# EAGLE board first_board5 (EAGLE 7.2.0)
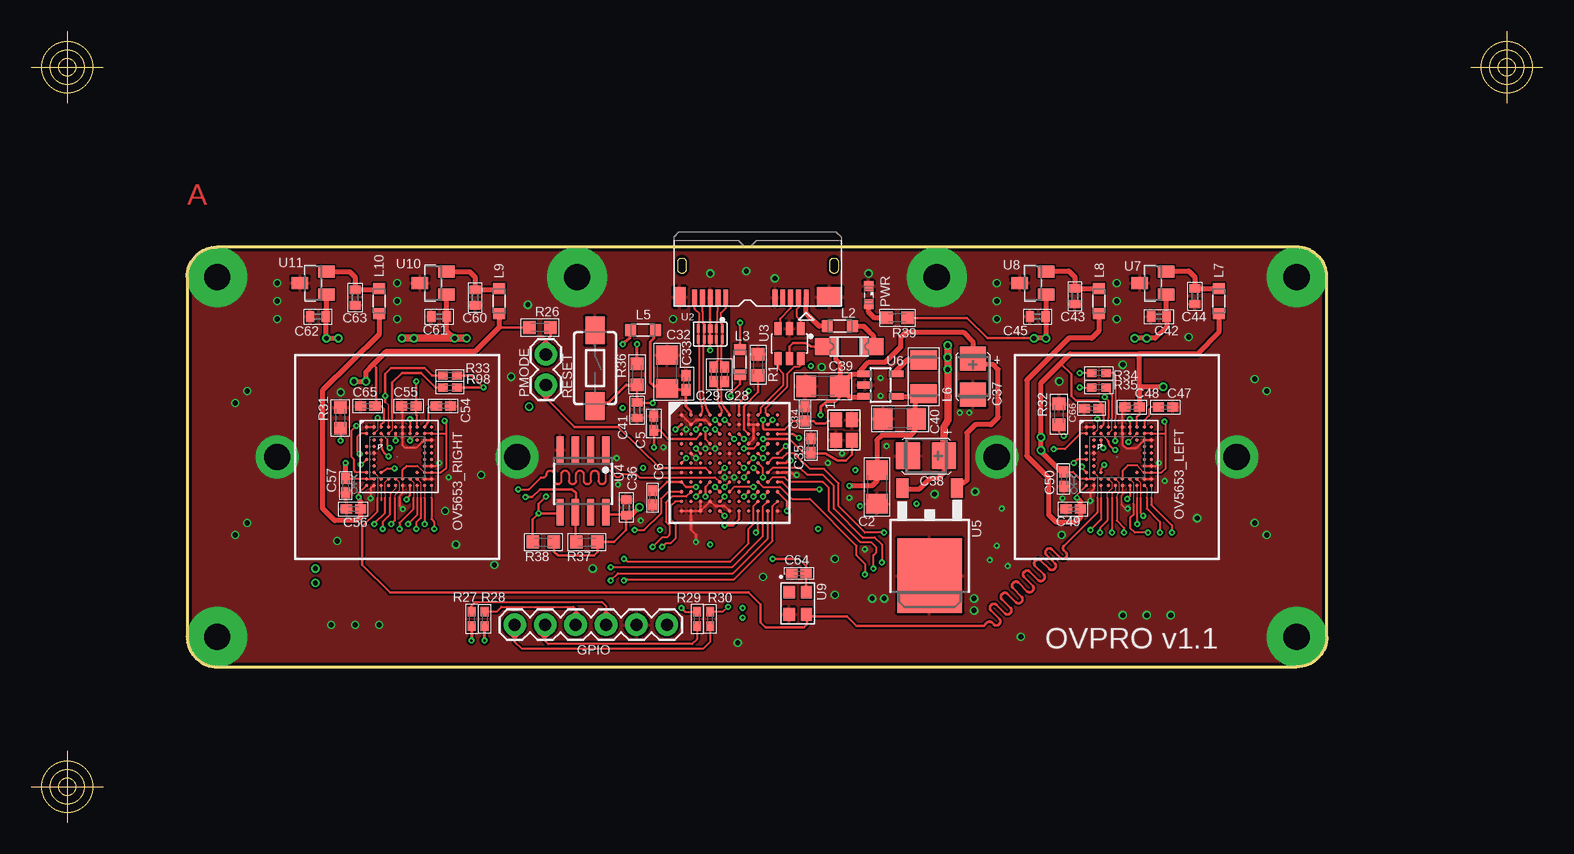
[diagram p2: board, top side]
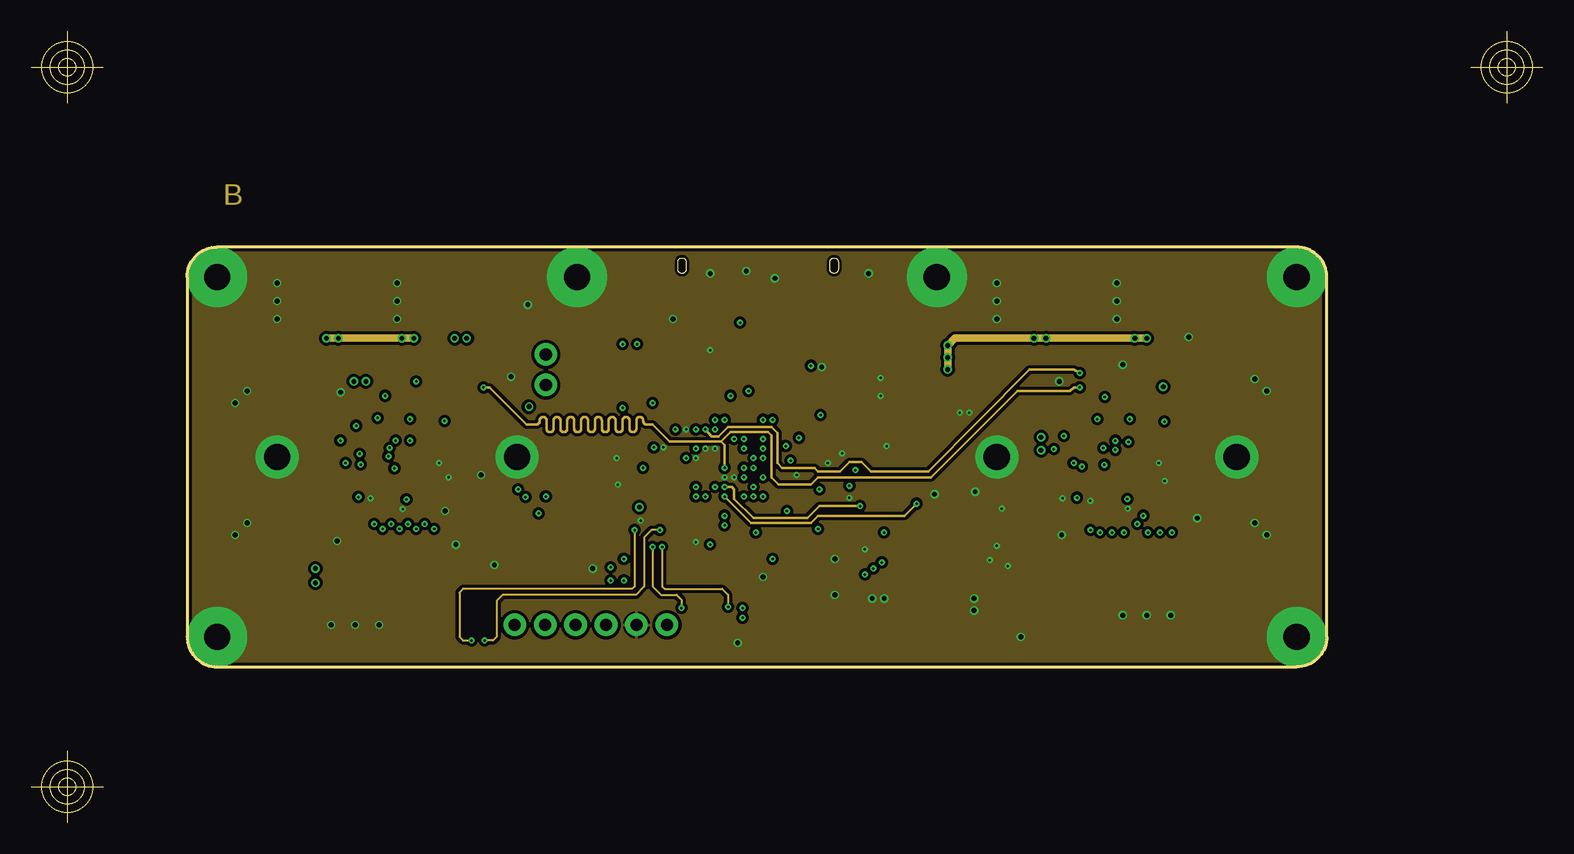
[diagram p3: board, inner layer GND,Signal]
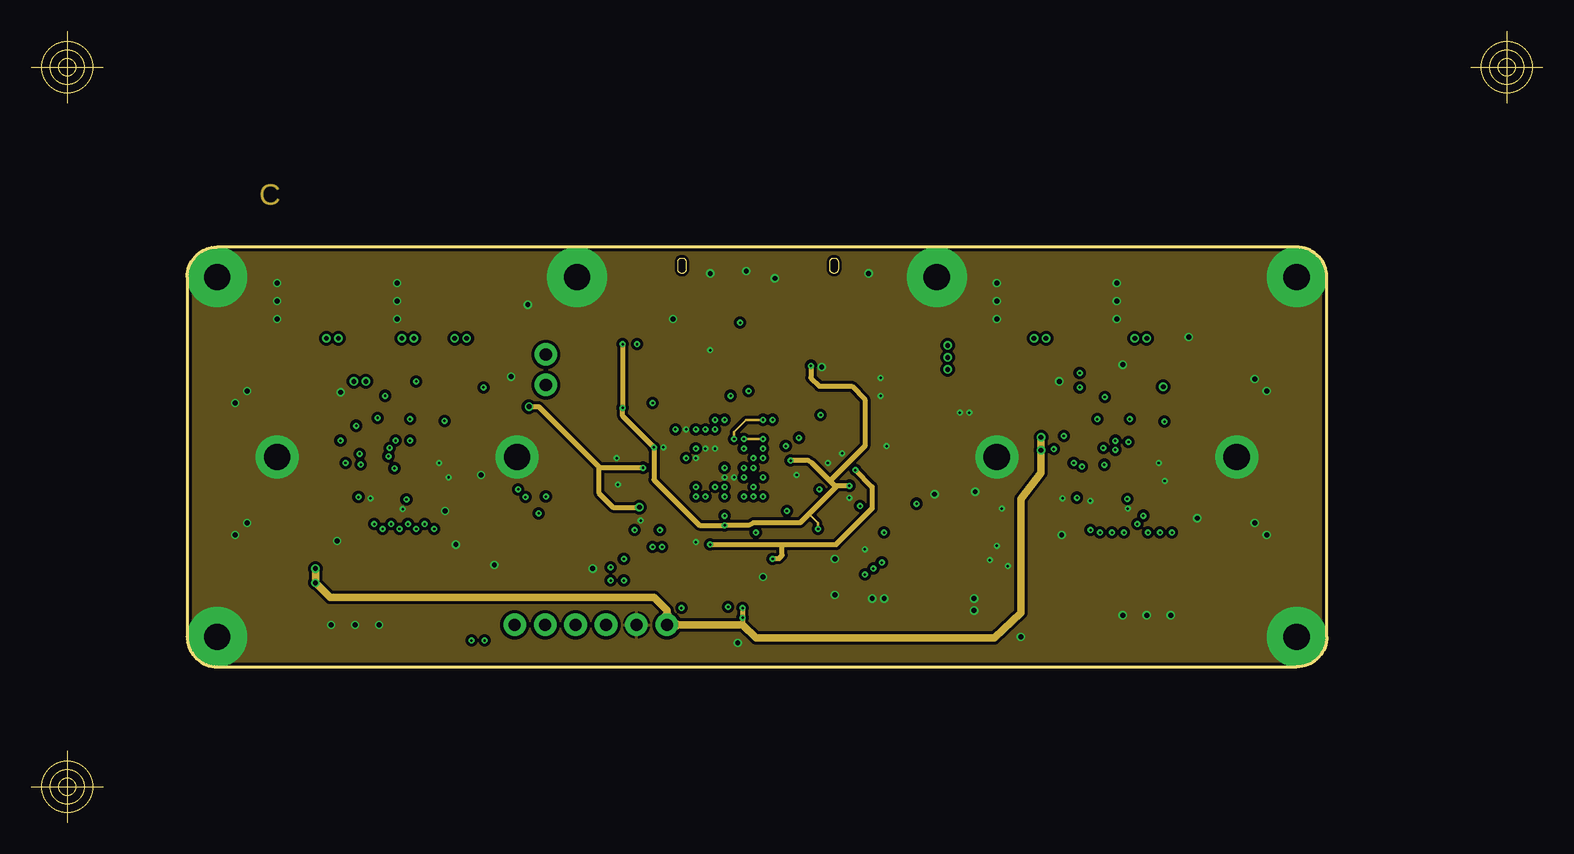
[diagram p4: board, inner layer Supply]
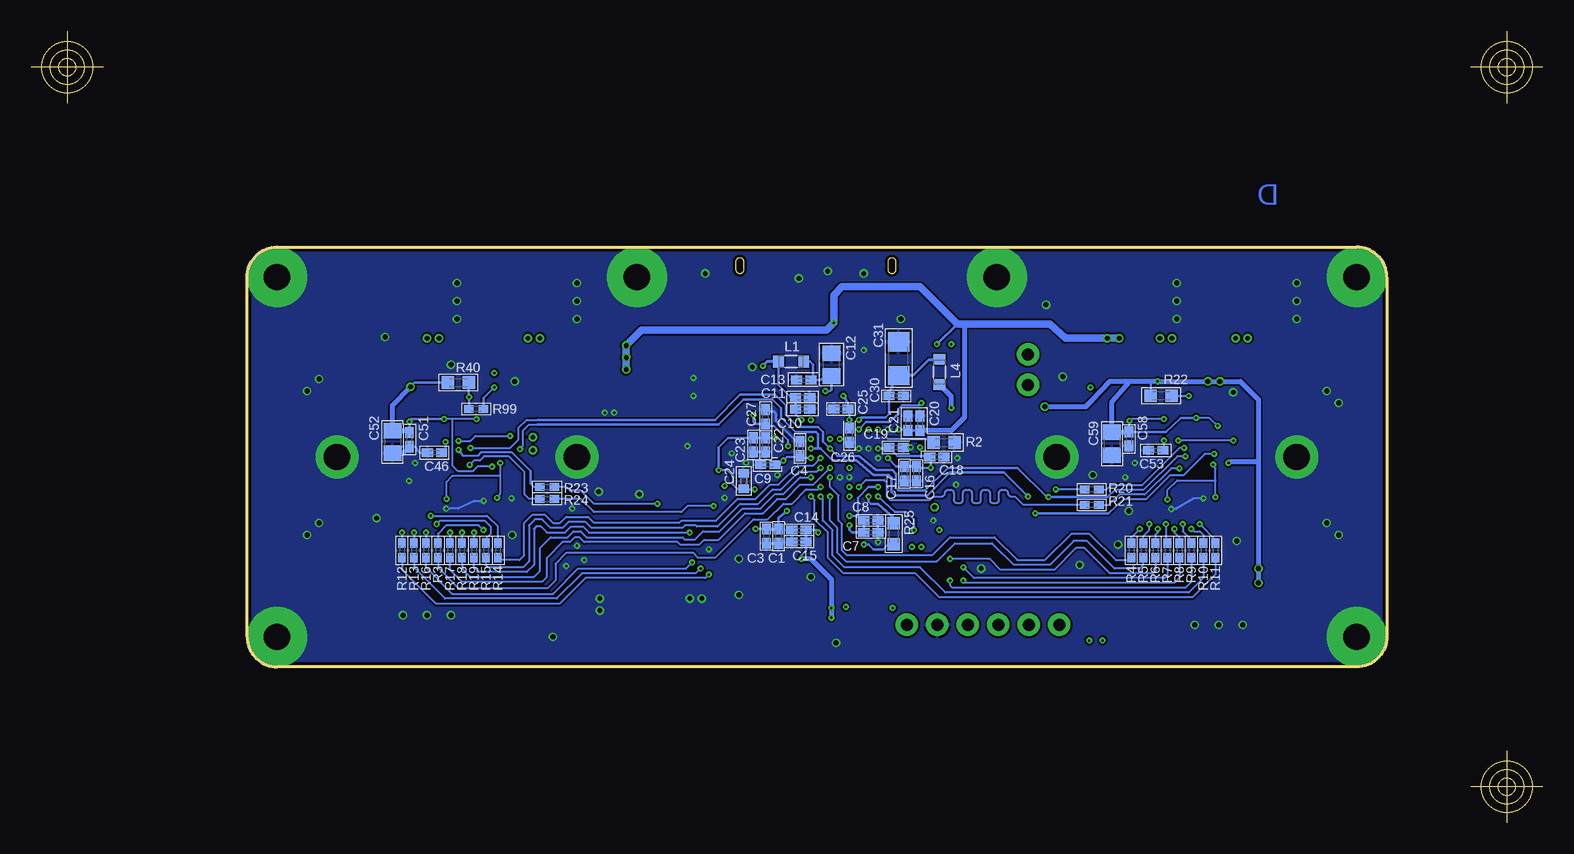
[diagram p5: board, bottom side, seen from below]

Size 126 x 66 mm. Coordinates in mm from the lower left corner, seen from the top.
Outline: 3,6 3,0
Outline: 0,3 6,3
Outline: 3,66 3,60
Outline: 0,63 6,63
Outline: 123,66 123,60
Outline: 120,63 126,63
Outline: 15.5,13 105.5,13 arc90 108,15.5 108,45.5 arc90 105.5,48 15.5,48 arc90 13,45.5 13,15.5 arc90 15.5,13
Outline: circle at 3,3 radius 1.41
Outline: circle at 3,3 radius 0.71
Outline: circle at 3,3 radius 2.12
Outline: circle at 3,63 radius 1.41
Outline: circle at 3,63 radius 0.71
Outline: circle at 3,63 radius 2.12
Outline: circle at 123,63 radius 1.41
Outline: circle at 123,63 radius 0.71
Outline: circle at 123,63 radius 2.12
Copper layers (1+2*15+16): Top 0.04mm / dielectric 0.11mm / GND,Signal 0.032mm / dielectric 0.3mm / Supply 0.032mm / dielectric 0.11mm / Bottom 0.04mm
Design rules "gihan_l4 *": minimum track width 0.1mm, minimum drill 0.2mm, track to track 0.149mm, track to pad 0.09mm, pad to pad 0.149mm, via to via 0.149mm, smd to smd 0.149mm, copper to edge 0.25mm, drill to drill 0.4mm, minimum pad ring 0.15mm, minimum via ring 0.15mm, stop-mask expansion 0.025mm, vias tented up to drill 0.1mm, thermal gap 0.2mm

## Footprints (pad centres in the part's own frame; a part is rotated, then mirrored left to right if it is on the bottom)
C0402K = smd 0.925 x 0.74: 1 -0.6,0; 2 0.6,0
C1206 = smd 1.6 x 1.8: 1 -1.4,0; 2 1.4,0
C0805 = smd 1.3 x 1.5: 1 -0.95,0; 2 0.95,0
C0402 = smd 0.7 x 0.9: 1 -0.65,0; 2 0.65,0
CT3528 = smd 2 x 2.2: + -1.5,0; - 1.5,0
1206L = smd 2 x 1.4: P$1 -1.85,0; P$2 1.85,0
LED_SML0603 = smd 0.8 x 0.8: A 0.75,0; C -0.75,0
ZX360D-B-10PUSB3 = smd 0.4 x 1.35: GND@1 6.7,2.675; GND@2 1.3,2.675; USB2_DM -0.65,2.675; USB2_DP 0,2.675; USB3_RXDM 7.35,2.675; USB3_RXDP 8,2.675; USB3_TXDM 5.4,2.675; USB3_TXDP 6.05,2.675; USBOTG 0.65,2.675; VBUS -1.3,2.675 | smd 2.1 x 1.6: PGND@1 -3.25,2.6 | smd 1 x 1.6: PGND@2 9.25,2.6
1X02 = drill 1.016 pad 1.88: 1 0,0; 2 2.54,0
1X06 = drill 1.016 pad 1.88: 1 0,0; 2 2.54,0; 3 5.08,0; 4 7.62,0; 5 10.16,0; 6 12.7,0
WE-CBA_0805(W=3) = smd 0.9 x 1: 1 -1.05,0; 2 1.05,0
L3225M = smd 1.6 x 2.2: 1 -1.4,0; 2 1.4,0
OV05653-A66A = smd 0.3 x 0.3: A01 -2.7,2.429; A02 -2.099,2.429; A03 -1.5,2.429; A04 -0.899,2.429; A05 -0.299,2.429; A06 0.3,2.429; A07 0.9,2.429; A08 1.5,2.429; A09 2.1,2.429; A10 2.7,2.429; B01 -2.7,1.889; B02 -2.099,1.889; B03 -1.5,1.889; B04 -0.899,1.889; B05 -0.299,1.889; B06 0.3,1.889; B07 0.9,1.889; B08 1.5,1.889; B09 2.1,1.889; B10 2.7,1.889; C02 -2.099,1.349; C03 -1.5,1.349; C08 1.5,1.349; C09 2.1,1.349; C10 2.7,1.349; D01 -2.7,0.809; D02 -2.099,0.809; D09 2.1,0.809; D10 2.7,0.809; E01 -2.7,0.27; E02 -2.099,0.27; E09 2.1,0.27; E10 2.7,0.27; F01 -2.7,-0.271; F02 -2.099,-0.271; F09 2.1,-0.271; F10 2.7,-0.271; G02 -2.099,-0.81; G09 2.1,-0.81; G10 2.7,-0.81; H01 -2.7,-1.351; H02 -2.099,-1.351; H03 -1.5,-1.351; H08 1.5,-1.351; H09 2.1,-1.351; H10 2.7,-1.351; I01 -2.7,-1.891; I02 -2.099,-1.891; I03 -1.5,-1.891; I04 -0.899,-1.891; I05 -0.299,-1.891; I06 0.3,-1.891; I07 0.9,-1.891; I08 1.5,-1.891; I09 2.1,-1.891; I10 2.7,-1.891; J01 -2.7,-2.43; J02 -2.099,-2.43; J03 -1.5,-2.43; J04 -0.899,-2.43; J05 -0.299,-2.43; J06 0.3,-2.43; J07 0.9,-2.43; J08 1.5,-2.43; J09 2.1,-2.43; J10 2.7,-2.43
SMD1608 = smd 1.05 x 1.08: 1 -0.875,0; 2 0.875,0
SMD1005 = smd 0.8 x 0.65: 1 -0.6,0; 2 0.6,0
TACTILE-SWITCH-1101NE = smd 2.3 x 1.6: 1 -3.15,0; 2 3.15,0
BGA121 = smd 0.3 x 0.3: A01 -4,4; A02 -3.2,4; A03 -2.4,4; A04 -1.6,4; A05 -0.8,4; A06 0,4; A07 0.8,4; A08 1.6,4; A09 2.4,4; A10 3.2,4; A11 4,4; B01 -4,3.2; B02 -3.2,3.2; B03 -2.4,3.2; B04 -1.6,3.2; B05 -0.8,3.2; B06 0,3.2; B07 0.8,3.2; B08 1.6,3.2; B09 2.4,3.2; B10 3.2,3.2; B11 4,3.2; C01 -4,2.4; C02 -3.2,2.4; C03 -2.4,2.4; C04 -1.6,2.4; C05 -0.8,2.4; C06 0,2.4; C07 0.8,2.4; C08 1.6,2.4; C09 2.4,2.4; C10 3.2,2.4; C11 4,2.4; D01 -4,1.6; D02 -3.2,1.6; D03 -2.4,1.6; D04 -1.6,1.6; D05 -0.8,1.6; D06 0,1.6; D07 0.8,1.6; D08 1.6,1.6; D09 2.4,1.6; D10 3.2,1.6; D11 4,1.6; E01 -4,0.8; E02 -3.2,0.8; E03 -2.4,0.8; E04 -1.6,0.8; E05 -0.8,0.8; E06 0,0.8; E07 0.8,0.8; E08 1.6,0.8; E09 2.4,0.8; E10 3.2,0.8; E11 4,0.8; F01 -4,0; F02 -3.2,0; F03 -2.4,0; F04 -1.6,0; F05 -0.8,0; F06 0,0; F07 0.8,0; F08 1.6,0; F09 2.4,0; F10 3.2,0; F11 4,0; G01 -4,-0.8; G02 -3.2,-0.8; G03 -2.4,-0.8; G04 -1.6,-0.8; G05 -0.8,-0.8; G06 0,-0.8; G07 0.8,-0.8; G08 1.6,-0.8; G09 2.4,-0.8; G10 3.2,-0.8; G11 4,-0.8; H01 -4,-1.6; H02 -3.2,-1.6; H03 -2.4,-1.6; H04 -1.6,-1.6; H05 -0.8,-1.6; H06 0,-1.6; H07 0.8,-1.6; H08 1.6,-1.6; H09 2.4,-1.6; H10 3.2,-1.6; H11 4,-1.6; J01 -4,-2.4; J02 -3.2,-2.4; J03 -2.4,-2.4; J04 -1.6,-2.4; J05 -0.8,-2.4; J06 0,-2.4; J07 0.8,-2.4; J08 1.6,-2.4; J09 2.4,-2.4; J10 3.2,-2.4; J11 4,-2.4; K01 -4,-3.2; K02 -3.2,-3.2; K03 -2.4,-3.2; K04 -1.6,-3.2; K05 -0.8,-3.2; K06 0,-3.2; K07 0.8,-3.2; K08 1.6,-3.2; K09 2.4,-3.2; K10 3.2,-3.2; K11 4,-3.2; L01 -4,-4; L02 -3.2,-4; L03 -2.4,-4; L04 -1.6,-4; L05 -0.8,-4; L06 0,-4; L07 0.8,-4; L08 1.6,-4; L09 2.4,-4; L10 3.2,-4; L11 4,-4
SP3010-04UTG = smd 0.2 x 0.675: P1 1,0.438; P2 0.5,0.438; P4 -0.5,0.438; P5 -1,0.438; P6 -1,-0.438; P7 -0.5,-0.438; P9 0.5,-0.438; P10 1,-0.438 | smd 0.4 x 0.675: P3 0,0.438; P8 0,-0.438
WE-82400102 = smd 0.6 x 1.1: P1 -0.95,-1.25; P2 0,-1.25; P3 0.95,-1.25; P4 0.95,1.25; P5 0,1.25; P6 -0.95,1.25
SO-08 = smd 0.6 x 2.2: 1 -1.905,-2.6; 2 -0.635,-2.6; 3 0.635,-2.6; 4 1.905,-2.6; 5 1.905,2.6; 6 0.635,2.6; 7 -0.635,2.6; 8 -1.905,2.6
TO-252 = smd 1 x 1.6: 1 -2.28,-4.8; 2 2.28,-4.8 | smd 5.4 x 6.2: 3 0,2.5
SOT23-5 = smd 0.55 x 1.2: 1 -0.95,-1.3; 2 0,-1.3; 3 0.95,-1.3; 4 0.95,1.3; 5 -0.95,1.3
SOT23 = smd 1 x 1.4: 1 -0.95,-1.1; 2 0.95,-1.1; 3 0,1.1
KC2520C-C2 = smd 1.05 x 0.95: 1 -0.925,-0.725; 2 0.925,-0.725; 3 0.925,0.725; 4 -0.925,0.725
NX2520SACRY = smd 1.2 x 1: P1 0,-1.3; P2 1.7,-1.3; P3 1.7,0; P4 0,0

## Placement (x,y rotation side)
C1  0.1uF 25V  [C0402K]  63.7,23.9 270 bottom
C2  22uF 10V  [C1206]  70.5,28 270 top
C3  0.01uF 25V  [C0402K]  64.7,23.9 270 bottom
C4  0.01uF 25V  [C0402K]  61.9,31.2 90 bottom
C5  0.1uF 25V  [C0402K]  51.9,33.3 90 top
C6  0.01uF 25V  [C0402K]  51.8,27.1 270 top
C7  0.1uF 25V  [C0402K]  56,24.2 0 bottom
C8  0.1uF 25V  [C0402K]  56,25.2 0 bottom
C9  0.01uF 25V  [C0402K]  64.6,29.85 180 bottom
C10  0.1uF 25V  [C0402K]  61.7,34.5 0 bottom
C11  0.01uF 25V  [C0402K]  61.7,35.45 0 bottom
C12  2.2uF 25V  [C0805]  59.3,38.2 90 bottom
C13  0.1uF 25V  [C0402K]  61.6,36.9 180 bottom
C14  0.1uF 25V  [C0402K]  62,24.4 180 bottom
C15  0.01uF 25V  [C0402K]  62,23.4 180 bottom
C16  0.01uF 25V  [C0402K]  52.2,29.1 270 bottom
C17  0.1uF 25V  [C0402K]  53.2,29.1 270 bottom
C18  0.01uF 25V  [C0402K]  50.5,30.5 0 bottom
C19  0.1uF 25V  [C0402K]  53.9,31.3 0 bottom
C20  0.1uF 25V  [C0402K]  51.9,33.3 90 bottom
C21  0.01uF 25V  [C0402K]  52.9,33.3 90 bottom
C22  0.1uF 25V  [C0402K]  64.8,31.5 270 bottom
C23  0.01uF 25V  [C0402K]  65.8,31.5 270 bottom
C24  0.1uF 25V  [C0402]  66.6,28.5 90 bottom
C25  0.1uF 25V  [C0402K]  58.5,34.5 180 bottom
C26  0.1uF 25V  [C0402K]  57.8,32.3 270 bottom
C27  0.1uF 25V  [C0402K]  64.8,33.85 270 bottom
C28  0.1uF 25V  [C0402K]  57.8,37.4 270 top
C29  0.1uF 25V  [C0402K]  56.9,37.4 270 top
C30  0.1uF 25V  [C0402K]  53.9,35.6 0 bottom
C31  22uF 10V  [C1206]  53.7,38.7 90 bottom
C32  22uF 10V  [C1206]  53,37.6 90 top
C33  0.1uF 25V  [C0402K]  54.6,36.7 90 top
C34  13pF 50V  [C0402K]  64.5,34.1 90 top
C35  13pF 50V  [C0402K]  65,31.45 90 top
C36  0.1uF 25V  [C0402]  49.6,26.3 90 top
C37  TRJB106K010R  [CT3528]  78.5,37.2 270 top
C38  TAJB226M010R  [CT3528]  74.6,30.6 180 top
C39  22uF 10V  [C1206]  66,36.4 180 top
C40  22uF 10V  [C1206]  72.4,33.7 180 top
C41  0.1uF 25V  [C0402]  50.5,34.4 270 top
C42  1uF 10V  [C0402]  94,42.2 180 top
C43  1uF 10V  [C0402]  87,43.9 270 top
C44  1uF 10V  [C0402]  97,43.9 270 top
C45  1uF 10V  [C0402]  83.9,42.2 180 top
C46  0.1uF 25V  [C0402K]  92.38,30.85 180 bottom
C47  0.1uF 25V  [C0402K]  94.58,34.65 0 top
C48  0.1uF 25V  [C0402K]  91.78,34.65 180 top
C49  0.1uF 25V  [C0402K]  86.88,26.15 180 top
C50  0.1uF 25V  [C0402K]  86.08,28.65 270 top
C51  0.1uF 25V  [C0402K]  94.47,31.95 270 bottom
C52  2.2uF 25V  [C0805]  95.88,31.75 270 bottom
C53  0.1uF 25V  [C0402K]  32.27,31.05 180 bottom
C54  0.1uF 25V  [C0402K]  34.38,34.75 0 top
C55  0.1uF 25V  [C0402K]  31.48,34.75 180 top
C56  0.1uF 25V  [C0402K]  26.88,26.16 180 top
C57  0.1uF 25V  [C0402K]  26.2,28.1 270 top
C58  0.1uF 25V  [C0402K]  34.5,32 270 bottom
C59  2.2uF 25V  [C0805]  35.9,31.6 270 bottom
C60  1uF 10V  [C0402]  37,43.8 270 top
C61  1uF 10V  [C0402]  34,42.2 180 top
C62  1uF 10V  [C0402]  23.9,42.2 180 top
C63  1uF 10V  [C0402]  27,43.8 270 top
C64  0.01uF 25V  [C0402K]  64,20.8 180 top
C65  0.1uF 25V  [C0402K]  28.05,34.75 180 top
C66  0.1uF 25V  [C0402K]  88.4,34.55 180 top
F1  1206L110SL  [1206L]  68.2,39.7 180 top
GREENLED  [LED_SML0603]  69.8,44 270 top
JP1  ZX360D-B-10PUSB3  [ZX360D-B-10PUSB3]  63.3,46.45 180 top
JP2  [1X02]  42.9,36.5 90 top
JP3  [1X06]  53,16.5 180 top
L1  MPZ2012S601A  [WE-CBA_0805(W=3)]  62.65,38.44 180 bottom
L2  BLM21PG221SN1D  [WE-CBA_0805(W=3)]  67.4,41.4 0 top
L3  MPZ2012S601A  [WE-CBA_0805(W=3)]  59.1,38.4 90 top
L4  MPZ2012S601A  [WE-CBA_0805(W=3)]  50.3,37.6 270 bottom
L5  MPZ2012S601A  [WE-CBA_0805(W=3)]  51,41.1 180 top
L6  2.2uH Wirewound  [L3225M]  74.4,37.2 270 top
L7  BLM21PG221SN1D  [WE-CBA_0805(W=3)]  99,43.5 270 top
L8  BLM21PG221SN1D  [WE-CBA_0805(W=3)]  89,43.5 270 top
L9  BLM21PG221SN1D  [WE-CBA_0805(W=3)]  39,43.5 270 top
L10  BLM21PG221SN1D  [WE-CBA_0805(W=3)]  29,43.5 270 top
OV5653_LEFT  OV05653-A66A  [OV05653-A66A]  90.67,30.55 0 top
OV5653_RIGHT  OV05653-A66A  [OV05653-A66A]  30.68,30.55 0 top
R1  6.04K/1%  [SMD1608]  60.6,38.2 90 top
R2  200/1%  [SMD1608]  49.9,31.7 0 bottom
R3  22/1%  [SMD1005]  92.1,22.7 270 bottom
R4  22/1%  [SMD1005]  34.3,22.7 270 bottom
R5  22/1%  [SMD1005]  33.3,22.7 270 bottom
R6  22/1%  [SMD1005]  32.3,22.7 270 bottom
R7  22/1%  [SMD1005]  31.3,22.7 270 bottom
R8  22/1%  [SMD1005]  30.3,22.7 270 bottom
R9  22/1%  [SMD1005]  29.3,22.7 270 bottom
R10  22/1%  [SMD1005]  28.3,22.7 270 bottom
R11  22/1%  [SMD1005]  27.3,22.7 270 bottom
R12  22/1%  [SMD1005]  95.1,22.7 270 bottom
R13  22/1%  [SMD1005]  94.1,22.7 270 bottom
R14  22/1%  [SMD1005]  87.1,22.7 270 bottom
R15  22/1%  [SMD1005]  88.1,22.7 270 bottom
R16  22/1%  [SMD1005]  93.1,22.7 270 bottom
R17  22/1%  [SMD1005]  91.1,22.7 270 bottom
R18  22/1%  [SMD1005]  90.1,22.7 270 bottom
R19  22/1%  [SMD1005]  89.1,22.7 270 bottom
R20  22/1%  [SMD1005]  37.6,27.8 180 bottom
R21  22/1%  [SMD1005]  37.6,26.5 180 bottom
R22  10K  [SMD1608]  31.8,35.6 0 bottom
R23  22/1%  [SMD1005]  83,28 0 bottom
R24  22/1%  [SMD1005]  83,27 0 bottom
R25  10K  [SMD1608]  54.1,24.1 90 bottom
R26  10K  [SMD1608]  42.4,41.3 0 top
R27  22/1%  [SMD1005]  36.7,17 270 top
R28  22/1%  [SMD1005]  37.8,17 270 top
R29  22/1%  [SMD1005]  55.5,17 90 top
R30  22/1%  [SMD1005]  56.6,17 90 top
R31  10K  [SMD1608]  25.77,33.75 270 top
R32  10K  [SMD1608]  85.67,34.05 270 top
R33  1K/5%  [SMD1005]  34.9,36.3 0 top
R34  1K/1%  [SMD1005]  89,37.5 180 top
R35  1K/1%  [SMD1005]  89,36.3 180 top
R36  10K  [SMD1608]  50.5,37.4 270 top
R37  2K  [SMD1608]  46.3,23.4 0 top
R38  2K  [SMD1608]  42.7,23.4 0 top
R39  470  [SMD1608]  72.2,42.1 180 top
R40  10K  [SMD1608]  90.4,36.7 0 bottom
R98  0:NL  [SMD1005]  34.9,37.3 180 top
R99  0:NL  [SMD1005]  88.9,34.5 180 bottom
S1  434 123 050 816  [TACTILE-SWITCH-1101NE]  47,37.9 270 top
U1  CYUSB301X-BZX  [BGA121]  58.2,30 0 top
U2  SP3010-04UTG  [SP3010-04UTG]  56.6,40.75 0 top
U3  WE-82400102  [WE-82400102]  63.2,39.95 180 top
U4  M24M02-DRMN6TP  [SO-08]  46,28.5 180 top
U5  AP7363-33D-13  [TO-252]  74.9,23.1 180 top
U6  SC189CSKTRT  [SOT23-5]  70.8,36.5 270 top
U7  AP7333-28SAG-7  [SOT23]  93.5,45 90 top
U8  AP7333-15SAG-7  [SOT23]  83.5,45 90 top
U9  KC2520C24.0000C2LE00  [KC2520C-C2]  63.9,18.3 270 top
U10  AP7333-28SAG-7  [SOT23]  33.5,45 90 top
U11  AP7333-15SAG-7  [SOT23]  23.5,45 90 top
Y1  NX2520SACRY  [NX2520SACRY]  68.4,33.6 270 top

## Tracks (layer width: path | path; a pad name or v marks a point on that pad's centre or on a via)
312  (via drill 0.2)
  Top 0.182: v60.2,29.6 U1.G09
  Bottom 0.182: v60.2,29.6 60.5,29.3 62,29.3 63.5,27.8 64.2,27.8 65.4,26.6 66.9,26.6 68.8,24.7 70.5,24.7 70.6,24.8 71.5,24.8 71.7,24.6 79.3,24.6 79.8,25.1 81.2,25.1 81.7,24.6 82.7,24.6 83.4,25.3 84,25.3 84.5,24.8 84.5,21.8 85,21.3 87.9,21.3 88.1,21.5 R15.2
321  (via drill 0.2)
  Top 0.182: U1.G10 61.8,29.6 64.1,29.6 64.7,29 66,29 66.9,28.1 66.9,26.2 69.3,23.8 70.3,23.8 70.9,23.2 v70.9,21.7
  Bottom 0.182: R16.2 93.1,21.3 90.9,19.1 82.5,19.1 80.4,21.2 71.4,21.2 v70.9,21.7
+3V3  (via drill 0.2, 0.4, 0.4 pad 0.3)
  Top 0.2: v53.7,32.8 U1.B01 | v59.1,41.7 L3.2 | R39.1 78,42.1 79.7,40.4 v83.6,40.4
  Top 0.254: R36.1 v50.5,39.9
  Top 0.406: U8.1 84.6,42.15 | 84.6,42.15 C45.1 | v92,40.4 93.7,40.4 94.65,41.35 C42.1 94.6,42.15 U7.1 | v25.6,40.4 v24.6,40.4 24.6,42.15 C62.1 24.6,42.25 U11.1 | 84.6,42.15 v84.6,40.4 v83.6,40.4 | U10.1 34.6,42.25 C61.1 34.6,42.15 34.6,41.1 v35.3,40.4 | C38.+ 76.1,29.2 75.6,28.7 74.9,28.7 74,27.8 72.92,27.8 U5.2
  Top 0.61: v30.9,40.4 v35.3,40.4 v36.3,40.4 | v76.4,39.8 v76.4,38.8 v76.4,37.8 76.4,33.6 76.1,33 C38.+
  GND,Signal 0.61: v93,40.4 v92,40.4 v84.6,40.4 v83.6,40.4 77,40.4 v76.4,39.8 v76.4,37.8 | v24.6,40.4 v30.9,40.4 v31.9,40.4
  Bottom 0.2: C20.1 C21.1 53.1,32.8 v53.7,32.8
  Bottom 0.254: 48.8,41.6 v50.5,39.9
  Bottom 0.406: 48.2,41.6 48.2,33.8 49.3,32.7 C20.1
  Bottom 0.61: v35.3,40.4 39.8,40.4 41.1,41.6 48.2,41.6 48.8,41.6 51.9,44.7 58.4,44.7 59.1,44 v59.1,41.7 59.7,41.1 75.1,41.1 v76.4,39.8 v76.4,37.8
+5V  (via drill 0.2)
  Top 0.2: v61.8,33.6 U1.B10 | U1.C03 55.4,32 53.1,32 52.4,32.7 C5.1 v51.9,31.3 | v57.8,25.6 U1.L05 | v63,26 63,26.8 U1.J11 | v61,30.4 U1.E09 | C6.1 52.3,27.7 53,28.4 U1.H01 54.6,28 v55.4,28 | U1.L07 59,25.3 58.5,24.8 v57.8,24.8 | v63.3,30.2 63.1,30.2 62.9,30 U1.F11 | 49.9,41.05 L5.2
  Top 0.254: v49.3,39.9 49.9,40.4 49.9,41.05
  Top 0.406: 73.65,35.55 L6.2 | U6.4 73.65,35.55 | C2.1 70.5,28.5 70.1,28.1 v68.2,28.1 | 70.3,29.7 C2.1 | 73.65,35.55 73.65,33.45 C40.1 73.6,32.6 73.3,32.3 70.9,32.3 70.5,31.9 C2.1
  Supply 0.2: v65.6,24.5 65.6,25 64.85,25.75
  Supply 0.406: v63.3,30.2 64.8,30.2 65.05,30.02 66.6,28.49 | 66.6,28.49 67.1,28 | 67.1,28 64.85,25.75 64.1,25 60.2,25 59.8,24.8 v57.8,24.8 55.7,24.8 51.9,28.6 v51.9,31.3 49.3,33.9 v49.3,34.6 v49.3,39.9 | v68.2,28.1 67,28.1 67.1,28 | v65,38.1 65,37.1 65.7,36.4 68.4,36.4 69.5,35.3 69.5,31.39 66.6,28.49
  Bottom 0.2: 57.1,25.5 C8.1 C7.1 57.6,24.2 57.8,24.4 v57.8,24.8 | 57.1,25.5 57.2,25.6 v57.8,25.6 | v61,30.4 61.6,30.4 C4.1 | v55.4,28 56.2,28 57.1,27.1 57.1,25.5 | v63,26 63.7,25.4 C1.1 | 63.76,38.4 L1.2 63.7,36.5 62.65,35.45 C11.1 C10.1 62.25,34.25 62.25,34.05 v61.8,33.6 | C9.1 63.6,29.9 v63.3,30.2 63,30.5 62,30.5 C4.1 | C4.1 61.9,30.7 | C3.1 v65.6,24.5
  Bottom 0.254: C3.1 C1.1 | L1.2 64.66,38.44 v65,38.1
  Bottom 0.406: v49.3,34.6 49.3,35.55 L4.2
D0  (via drill 0.2)
  Top 0.1: OV5653_LEFT.I04 90.08,28.37 90.08,27.88 89.7,27.5 89.7,27.1
  Top 0.15: v89.1,24.2 89.1,24.6 89.7,25.2 89.7,27.1
  Bottom 0.182: R19.1 v89.1,24.2
D1  (via drill 0.2)
  Top 0.1: OV5653_LEFT.J05 90.38,27.68 90.1,27.4 90.1,27.1
  Top 0.15: 90.1,24.6 v90.1,24.2 90.1,27.1
  Bottom 0.182: R18.1 v90.1,24.2
D2  (via drill 0.2)
  Top 0.1: OV5653_LEFT.I05 90.67,28.37 90.67,27.5 90.5,27.32 90.5,27.1
  Top 0.15: 90.5,27.1 90.5,25.2 91.1,24.6 v91.1,24.2
  Bottom 0.182: v91.1,24.2 R17.1
D3  (via drill 0.2)
  Top 0.1: OV5653_LEFT.I07 91.88,28.37 91.88,26.6
  Top 0.15: v93.1,24.2 92,24.2 91.6,24.6 91.6,25.4 91.88,25.68 91.88,26.6
  Bottom 0.182: v93.1,24.2 R16.1
D4  (via drill 0.2)
  Top 0.1: OV5653_LEFT.J08 92.17,27.1
  Top 0.15: 92.17,27.1 92.17,24.93 v92.2,24.9
  Bottom 0.182: v92.2,24.9 91.9,25.2 88.2,25.2 87.7,24.7 87.7,24.1 88.1,23.7 R15.1
D5  (via drill 0.2)
  Top 0.1: 92.47,27.1 92.47,28.37 OV5653_LEFT.I08
  Top 0.15: 92.47,27.1 92.47,25.82 v92.7,25.6
  Bottom 0.182: R14.1 87.1,24.7 88,25.6 v92.7,25.6
D6  (via drill 0.2)
  Top 0.1: OV5653_LEFT.J09 93,27.89 93,27.1
  Top 0.15: v94.1,24.2 94.1,25.1 93,26.2 93,27.1
  Bottom 0.182: v94.1,24.2 R13.1
D7  (via drill 0.2)
  Top 0.1: OV5653_LEFT.J10 93.38,27.1
  Top 0.15: 93.38,27.1 93.38,26.5 95.1,24.8 v95.1,24.2
  Bottom 0.182: v95.1,24.2 R12.1
D8  (via drill 0.2)
  Top 0.1: OV5653_RIGHT.I04 29.48,28.37 29.48,27.43 29.5,27.3 29.5,27.1
  Top 0.15: v28.6,24.9 28.6,24.95 29.5,25.85 29.5,27.1
  Bottom 0.182: v28.6,24.9 27.3,23.6 R11.1
D9  (via drill 0.2)
  Top 0.1: OV5653_RIGHT.J05 30.38,27.88 29.9,27.4 29.9,27.1
  Top 0.15: v29.3,24.5 29.3,25.1 29.9,25.7 29.9,27.1
  Bottom 0.182: v29.3,24.5 29.1,24.3 28.6,24.3 28.3,24 R10.1
  Bottom 0.2: 28.3,23.6 R10.1
D10  (via drill 0.2)
  Top 0.1: OV5653_RIGHT.I05 30.44,28.66 30.68,28.4 30.68,27.7 30.3,27.3 30.3,27.1
  Top 0.15: 30.3,27.1 30.3,25.2 v30,24.9
  Bottom 0.182: v30,24.9 30,24.3 29.4,23.7 29.4,23.4
  Bottom 0.2: 29.3,23.4 R9.1 29.4,23.4
D11  (via drill 0.2)
  Top 0.1: OV5653_RIGHT.I07 31.88,28.37 31.88,27.1
  Top 0.15: 31.88,27.1 31.88,26.18 30.7,25 v30.7,24.5
  Bottom 0.182: R8.1 30.3,23.8 30.7,24.2 v30.7,24.5
D12  (via drill 0.2)
  Top 0.1: OV5653_RIGHT.J08 32.17,27.1 | OV5653_RIGHT.J08
  Top 0.15: 32.17,27.1 32.17,25.68 v31.4,24.9
  Bottom 0.182: v31.4,24.9 31.4,23.5 R7.1
D13  (via drill 0.2)
  Top 0.1: 32.48,27.1 32.48,28.37 OV5653_RIGHT.I08
  Top 0.15: 32.48,27.1 32.48,25.4 32.1,25.02 v32.1,24.5
  Bottom 0.182: v32.1,24.5 32.1,24.2 32.3,24 R6.1
D14  (via drill 0.2)
  Top 0.1: OV5653_RIGHT.J09 32.78,27.1 32.77,27.1
  Top 0.15: 32.77,27.1 32.77,24.93 v32.8,24.9
  Bottom 0.182: R5.1 33.3,23.9 32.8,24.4 v32.8,24.9
D15  (via drill 0.2)
  Top 0.1: OV5653_RIGHT.J10 33.38,27.1
  Top 0.15: 33.38,27.1 33.38,25.32 33.6,25.1 v33.6,24.5
  Bottom 0.182: R4.1 34.3,23.8 v33.6,24.5
FREX  (via drill 0.2)
  Top 0.15: v87.4,36.3 R35.2
  Top 0.2: U1.G05 v57.8,29.6 | R33.2 v37.7,36.3 36.7,37.3 R98.1
  GND,Signal 0.2: v37.7,36.3 38.2,36.3 41.3,33.2 42.1,33.2 arc90 42.39,33.49 42.39,33.55 arc-90 42.67,33.84 42.68,33.84 arc-90 42.96,33.55 42.96,32.85 arc90 43.25,32.56 43.25,32.56 arc90 43.54,32.85 43.54,33.55 arc-90 43.82,33.84 43.83,33.84 arc-90 44.11,33.55 44.11,32.85 arc90 44.4,32.56 44.4,32.56 arc90 44.69,32.85 44.69,33.55 arc-90 44.98,33.84 44.98,33.84 arc-90 45.27,33.55 45.27,32.85 arc90 45.55,32.56 45.55,32.56 arc90 45.84,32.85 45.84,33.55 arc-90 46.13,33.84 46.13,33.84 arc-90 46.42,33.55 46.42,32.85 arc90 46.7,32.56 46.71,32.56 arc90 46.99,32.85 46.99,33.55 arc-90 47.28,33.84 47.28,33.84 arc-90 47.57,33.55 47.57,32.85 arc90 47.85,32.56 47.86,32.56 arc90 48.14,32.85 48.14,33.55 arc-90 48.43,33.84 48.43,33.84 arc-90 48.72,33.55 48.72,32.85 arc90 49.01,32.56 49.01,32.56 arc90 49.3,32.85 49.3,33.55 arc-90 49.58,33.84 49.58,33.84 arc-90 49.87,33.55 49.87,32.85 arc90 50.16,32.56 50.16,32.56 arc90 50.45,32.85 50.45,33.55 arc-90 50.73,33.84 50.74,33.84 arc-90 51.02,33.55 51.02,33.49 arc90 51.31,33.2 51.8,33.2 53.2,31.8 57.5,31.8 | 57.5,31.8 58.3,32.6 61.4,32.6 61.7,32.3 61.7,28.8 62.3,28.2 65,28.2 65.6,28.8 75,28.8 82.2,36 86.6,36 86.9,36.3 v87.4,36.3 | v57.8,29.6 57.8,31.5 57.5,31.8
  Bottom 0.2: R99.1 88.3,35.4 v87.4,36.3
GND  (via drill 0.2, 0.2 pad 0.3, 0.4, 2.2 pad 3.6, 2.2 pad 5)
  Top 0.1: OV5653_LEFT.A01 | OV5653_LEFT.J06 90.97,27.38 90.9,27.3 90.9,26.5 | OV5653_RIGHT.J06 30.98,27.48 30.7,27.2 30.7,27.1
  Top 0.15: OV5653_RIGHT.C10 OV5653_RIGHT.C09 32.58,31.75 32.08,31.25 31.18,31.25 30.98,31.45 arc0 OV5653_RIGHT.B06 OV5653_RIGHT.A06 30.98,34.73 C55.2 | OV5653_RIGHT.I09 OV5653_RIGHT.I10 | OV5653_RIGHT.A02 OV5653_RIGHT.A01 | OV5653_RIGHT.J02 28.27,27.86 v28.27,27.05 | OV5653_LEFT.J02 88.58,27.85 88.28,27.55 v88.28,26.85 | C48.2 90.97,34.45 OV5653_LEFT.A06 OV5653_LEFT.B06 90.97,31.55 91.28,31.25 92.08,31.25 92.28,31.4 OV5653_LEFT.C09 OV5653_LEFT.C10 | OV5653_LEFT.I09 OV5653_LEFT.I10 | OV5653_LEFT.E02 88.5,30.82 | 32.76,29.74 OV5653_RIGHT.G09 OV5653_RIGHT.G10 33.74,29.74 v34,30 | OV5653_LEFT.A02 OV5653_LEFT.A01 | v91.4,26.2 91.2,26.2 90.9,26.5 | 30.7,27.1 30.7,26.43 v30.98,26.16 | OV5653_LEFT.G09 OV5653_LEFT.G10 93.75,29.74 v94,30
  Top 0.2: U1.A01 U1.B02 55.4,33.6 56.2,33.6 U1.B04 | U1.L03 U1.L02 | U1.L02 U1.L01 | U1.L03 U1.K04 57,26.4 57.8,26.4 U1.L06 | U1.K03 U1.L03 | U1.G11 63.2,29.2 v63.8,29 | U1.L02 55,24.4 55.4,24 v55.4,23.4 | U1.B09 60.2,33.2 | 60.2,33.2 60.2,32 U1.D08 | 60.2,33.2 U1.B08 U1.A08 | U1.E02 v55.4,30.4 | v56.6,39.4 U2.P8 U2.P3 56.6,43.7
  Bottom 0.15: v28.27,27.05 29.07,27.05 30.57,26.16 v30.98,26.16 | v88.28,26.85 89.05,26.85 90.4,26.2 v91.4,26.2 | C46.2 93.58,30.85 93.97,31.35 C51.2 94.38,31.25
  Bottom 0.2: C23.2 C22.2 | v55.4,23.4 C7.2 C8.2 | C1.2 C3.2 | R2.2 49.02,31.48 | 61.8,31.8 C4.2 62.2,31.8 63.9,33.5 63.9,34.1 64.1,34.3 64.7,34.3 C27.1 | 32.8,31 32.86,31.05 C53.2 32.88,30.88
  Bottom 0.406: C52.2 95.03,30.8 C51.2
  other vias: 15.5,45.5 105.5,45.5 105.5,15.5 100.5,30.5 80.5,30.5 20.5,30.5 40.5,30.5 57,31.2 94.5,28.5 48.8,30.4 20.5,45 20.5,43.5 20.5,42 30.5,45 30.5,43.5 30.5,42 50.8,25.2 80.5,45 80.5,43.5 80.5,42 90.5,45 90.5,43.5 90.5,42 71.1,18.7 78.6,17.7 75.3,27.4 78.7,27.6 93,17.3 27,16.5 34.5,26 40,37.2 57.8,28.8 54.6,32.8 66.4,30 67.6,30.8 37.5,29 52.7,31.3 58.6,28.8 67,22 58.9,15 18,25 18,36 102,25 102,37 53.5,42 69.8,45.8 59.6,46 97.2,25.4 91,38.2 85.97,27.05 48.9,28.2 103,36 103,24 17,24 17,35 95,17.3 91,17.3 29,16.5 25,16.5 82.5,15.5 15.5,15.5 80.9,26.2 25.8,35.9 45.5,45.5 75.5,45.5 41.4,43.2 62,45.4 34.8,28.8 85.7,36.8 67,19 61,20.5 25.5,23.5 65.9,38 56.2,31.2 38.6,21.5 35.4,23.2 85.9,24 79.9,21.9 81.4,21.4 68.2,27.1 70.1,18.7 78.6,18.7 46.8,21.2 96.5,40.5 80.5,23.1 69.5,22.8 77.4,34.2 71.3,31.4 56.6,45.8 78.2,34.2 70.8,37.1 70.8,35.6
  pour Top (isolate 0.15): 12.5,48.5 12.5,12.5 108.5,12.5 108.5,48.5
  pour Bottom (isolate 0.15): 11,50 11,11 110,11 110,50
  pour GND,Signal (isolate 0.254): 12,49 12,12 109,12 109,49
  pour Supply (isolate 0.254): 11.5,49.5 11.5,11.5 109.5,11.5 109.5,49.5
HREF  (via drill 0.2)
  Top 0.15: OV5653_LEFT.H03 89.17,29.45 v89.45,29.85
  Bottom 0.15: 84.88,29.25 86.17,30.55 88.25,30.55 88.6,30.2 89.1,30.2 v89.45,29.85
  Bottom 0.182: R24.1 84.5,27 84.88,27.38 84.88,29.25
HREF2  (via drill 0.2)
  Top 0.15: OV5653_RIGHT.H03 29.68,29.55 v30.27,29.55
  Bottom 0.15: v30.27,29.55 30.98,29.55 33.17,27.36 35.27,27.36 36.2,26.5 R21.1
I2C_SCL  (via drill 0.2)
  Top 0.15: OV5653_LEFT.C03 89.17,31.35 v89.38,31.25 | OV5653_RIGHT.C03 29.18,31.55 arc60 v29.77,30.55
  Top 0.2: v41.2,27.15 41.75,27.15 42.4,27.8 45.1,27.8 45.4,27.5 45.4,26.87 U4.6 45.37,23.39 R37.1 | U1.D09 60.2,31.2 v59.4,31.2
  Bottom 0.15: v29.77,30.55 30.48,30.55 33.27,27.76 35.67,27.76 36.3,27.15 | v89.38,31.25 86.08,31.25 85.4,31.93 85.4,32.9 84.7,33.6 83.8,33.6
  Bottom 0.2: 36.3,27.15 v41.2,27.15 41.35,27.15 43.8,29.6 49.6,29.6 51.5,27.7 53.7,27.7 53.9,27.9 53.9,29.1 54.2,29.4 55.6,29.4 57,30.6 58.8,30.6 v59.4,31.2 60,31.8 60,32.6 60.4,33 62.1,33 63.1,34 63.1,34.8 64,35.7 66.9,35.7 69,33.6 83.8,33.6
I2C_SDA  (via drill 0.2)
  Top 0.15: OV5653_RIGHT.B01 27.46,32.45 27.18,32.16 27.18,30.95 v27.38,30.75 | OV5653_LEFT.B01 87.47,32.45 86.17,31.15 v85.25,31.15
  Top 0.2: U1.D10 v61,31.2 | v42.3,25.8 41.8,25.3 41.8,23.93 R38.1 | v42.3,25.8 42.3,26.6 v42.9,27.2 | v42.3,25.8 44,25.8 U4.5
  Bottom 0.15: v27.38,30.75 28.18,30.75 29.98,28.95 31.07,28.95 33.08,26.95 34.98,26.95 36.2,25.8 | 83.8,33.2 84.5,33.2 85,32.7 85,31.4 v85.25,31.15
  Bottom 0.2: v42.9,27.2 44.9,29.2 49.4,29.2 51.3,27.3 54,27.3 54.3,27.6 54.3,28.8 54.5,29 55.8,29 57.2,30.2 59.2,30.2 60.2,31.2 60.4,31.2 | 83.8,33.2 68.7,33.2 66.6,35.3 64.2,35.3 63.5,34.6 63.5,33.8 62.3,32.6 60.6,32.6 60.4,32.4 60.4,31.2 | 60.4,31.2 v61,31.2 | 36.2,25.8 v42.3,25.8
MCLK
  Top 0.1: 88.88,27.1 88.88,28.9 OV5653_LEFT.H02 | OV5653_RIGHT.H02 28.88,28.91 28.88,27.1
  Top 0.15: 88.88,27.1 88.88,25.88 86.1,23.1 | 27.6,24.7 28.88,25.98 28.88,27.1
  Top 0.2: 27.6,24.7 27.6,21.5 29.9,19.2 59.8,19.2 60.8,18.2 60.8,16.7 61.2,16.3 64.4,16.3 64.65,16.55 64.65,17.35 U9.3 64.8,17.2 68,17.2 68.8,16.4 79.4,16.4 79.69,16.68 arc-90 80.09,16.68 80.25,16.52 arc90 80.66,16.52 80.71,16.58 arc90 80.71,16.99 79.99,17.71 arc-90 79.99,18.12 80.04,18.18 arc-90 80.45,18.18 81.17,17.45 arc90 81.58,17.45 81.64,17.51 arc90 81.64,17.91 80.91,18.64 arc-90 80.91,19.04 80.97,19.1 arc-90 81.37,19.1 82.1,18.37 arc90 82.5,18.37 82.56,18.43 arc90 82.56,18.84 81.84,19.56 arc-90 81.84,19.97 81.89,20.02 arc-90 82.3,20.02 83.03,19.3 arc90 83.43,19.3 83.49,19.36 arc90 83.49,19.76 82.76,20.49 arc-90 82.76,20.89 82.82,20.95 arc-90 83.22,20.95 83.95,20.22 arc90 84.35,20.22 84.41,20.28 arc90 84.41,20.68 83.69,21.41 arc-90 83.69,21.82 83.74,21.87 arc-90 84.15,21.87 84.87,21.15 arc90 85.28,21.15 85.34,21.2 arc90 85.34,21.61 84.61,22.34 arc-90 84.61,22.74 84.67,22.8 arc-90 85.07,22.8 85.8,22.07 arc90 86.2,22.07 86.26,22.13 arc90 86.26,22.54 86.1,22.7 arc-90 86.1,23.1
N$1  (via drill 0.2)
  Top 0.2: U1.B03 v55.4,32.8
  Bottom 0.2: v55.4,32.8 54.6,32 51.1,32 R2.1
N$2  (via drill 0.2)
  Top 0.2: v59.8,36 59.8,35.8 59,35 U1.A07
  Bottom 0.2: L1.1 61.09,38.44 60.85,38.2 60.85,37.15 C13.1 | C13.1 60.95,36.95 | C13.1 60.2,36.9 60.05,37.05 C12.1 59.37,36.71 59.3,36.6 59.3,36.1 59.4,36 v59.8,36
N$4
  Top 0.2: R1.1 60.6,35.9 59.4,34.7 59.4,32.8 U1.C08
N$13
  cutout Top: 54.95,43 54.95,34.05 58.25,34.05 58.25,43
N$23
  Top 0.1: 0,3 6,3
N$24
  Top 0.1: 3,6 3,0
N$25
  Top 0.1: 3,66 3,60
N$26
  Top 0.2: R26.2 43.3,41.17 43.3,40.6 42.9,40.2 42.9,40.06 JP2.2
  Top 0.4: 42.9,40.06 42.39,39.58 JP2.2 43.41,39.58 42.9,40.06
N$27  (via drill 0.2)
  Top 0.2: U1.H04 56.2,28 v56.2,27.2
  Bottom 0.2: 54.1,25.1 R25.2 54.1,25.4 55.4,26.6 56,26.6 56.2,26.8 v56.2,27.2
N$28
  Top 0.1: 0,63 6,63
N$29  (via drill 0.2)
  Top 0.2: v57.8,33.6 U1.B06 | L3.1 59.1,36.6 58.3,35.8 v58.3,35.6
  Bottom 0.2: v58.3,35.6 57.9,35 C25.1 57.8,34.3 v57.8,33.6 C26.1
N$30
  Top 0.406: U6.5 71.9,37.5 73,38.6 L6.1 74,38
N$31
  Top 0.2: 70.2,39.65 F1.P$1
  Top 0.406: L2.2 69.39,41.41 69.8,41 70.2,40.61 70.2,39.65
N$32
  Top 0.406: 94.65,46 96.5,46 97,45.5 C44.1 L7.1
  Top 0.61: U7.2 94.65,46
N$33
  Top 0.15: JP1.USB2_DM 63.95,42.95 63.8,42.8 63.8,42.2 64.15,41.85 U3.P1
N$34
  Top 0.15: U3.P3 62.4,41.35 62.4,42 63.3,42.9 JP1.USB2_DP
N$35
  Top 0.254: U1.A02 55,34.3 54.6,34.7 C33.1 53.1,36.1 | 53.35,36.4 51.9,36.4 51.6,36.7 51.6,40.1 51.9,40.4 51.9,40.95
  Top 0.406: 53.35,36.4 C32.1 53.1,36.1 | 51.9,40.95 L5.1
N$36
  Top 0.15: U1.A10 61.2,34.2 61.2,34.55 63,36.35 63,37.4 63.6,38 64,38 64.15,38.15 U3.P6
N$37
  Top 0.15: 62.3,39.2 U3.P4 62.25,37.9 62.7,37.4 62.7,36.5 60.8,34.6 60.8,34.2 U1.A09
N$38  (via drill 0.2)
  Top 0.2: U1.B05 v57,33.6
  Bottom 0.2: L4.1 50.4,38.6 | C30.1 54.5,34.1 54.8,33.8 56.8,33.8 v57,33.6
  Bottom 0.254: 50.4,38.6 51.2,38.6 52.5,37.3 C31.1 54.2,36.7 54.2,36.3 54.5,36 C30.1
N$39  (via drill 0.2)
  Top 0.2: v61,33.6 61,32.9 61.1,32.8 62.8,32.8 63.5,33.5 C34.1 65.2,33.5 65.4,33.3 66.2,33.3 66.4,33.5 66.8,33.5 Y1.P1 67,33.7 | U1.C06 v58.6,32
  Supply 0.2: v58.6,32 58.6,32.6 59.6,33.6 v61,33.6
N$40  (via drill 0.2)
  Top 0.2: v59.4,32 U1.C07 | v61,32 63.2,32 63.8,31.4 64.35,30.9 64.4,30.85 C35.1 65.05,30.8 66.2,30.8 67.2,30.2 67.9,30.2 68.4,30.7 Y1.P3
  Supply 0.2: v59.4,32 v61,32
N$41
  Top 0.406: R39.2 70.3,42.1 69.8,42.6 GREENLED.A
N$42
  Top 0.1: 120,63 126,63
N$43
  Top 0.15: C47.1 93.38,34.65 93.17,34.45 93.17,33.95 92.78,33.55 OV5653_LEFT.A09
N$44
  Top 0.1: 123,66 123,60
N$45  (via drill 0.2)
  Top 0.1: OV5653_LEFT.B08 v91.47,31.75
  Bottom 0.15: v91.47,31.75 91.47,31.35 C46.1
N$46
  Top 0.15: C28.2 57.8,36.6 57.5,36.3 57.5,35.5 arc37 57.8,34.6 arc-6 U1.A06
N$47
  Top 0.15: C29.2 56.9,36.6 57.2,36.3 57.2,35.5 arc33 57.5,34.5 arc-89 U1.A05
N$48  (via drill 0.2)
  Top 0.15: R31.2 v25.77,31.86
  Top 0.2: v30.38,31.86 30.38,32.25 OV5653_RIGHT.B05
  Bottom 0.15: v25.77,31.86 v30.38,31.86
N$49
  Top 0.182: R30.1 56.6,15.1 56,14.5 40.9,14.5 40.3,15.1 40.3,15.48 JP3.6
  Top 0.364: 40.3,15.48 40.8,15.94 JP3.6 39.8,15.94 40.3,15.48
N$50  (via drill 0.2)
  Top 0.15: v90.38,31.85 90.38,32.34 OV5653_LEFT.B05 | R32.2 85.67,32.55 v86.08,32.25
  Bottom 0.15: v90.38,31.85 89.38,31.85 88.97,32.25 v86.08,32.25
N$51
  Top 0.182: R29.1 55.5,15.3 55.1,14.9 43.1,14.9 42.8,15.2 42.8,15.48 42.8,16.44 JP3.5
  Top 0.364: 42.8,15.48 43.32,15.91 JP3.5 42.31,15.96 42.8,15.48
N$52
  Top 0.182: JP3.4 45.4,17.32 45.4,17.52 45.4,17.8 45.2,18 39.2,18 38.8,17.6 R28.1
  Top 0.364: 45.4,17.52 44.89,17.07 JP3.4 45.9,17.05 45.4,17.52
N$53
  Top 0.182: R27.1 36.7,18.1 37,18.4 47.6,18.4 47.9,18.1 47.9,17.52 47.9,16.6
  Top 0.2: 47.9,16.6 JP3.3
  Top 0.364: 47.9,17.52 47.4,17.05 JP3.3 48.41,17.07 47.9,17.52
N$54  (via drill 0.2)
  Top 0.182: U1.K01 53.7,26.8 53.3,26.4 53.3,25.3 53.7,24.9 53.7,23.7 53.3,23.3 52.9,23.3 v52.6,23 | v58.1,18 57.62,17.6 R30.2
  GND,Signal 0.182: v52.6,23 52.6,19.7 52.8,19.5 57.6,19.5 58.1,19 v58.1,18
N$55  (via drill 0.2)
  Top 0.182: U1.J02 54.6,27.2 53.4,27.2 52.9,26.7 52.9,25.1 53.2,24.8 53.2,24 53,23.8 52.6,23.8 v51.8,23 | v54.2,17.9 54.5,17.6 R29.2
  GND,Signal 0.182: v51.8,23 51.8,19.7 52.5,19 53.8,19 54.2,18.6 v54.2,17.9
N$56  (via drill 0.2)
  Top 0.2: U1.J03 v55.4,27.2
  Top 0.254: v37.8,15.2 R28.2
  GND,Signal 0.182: v52.4,24.4 51.7,24.4 51.1,23.8 51.1,19.7 50.4,19 39.3,19 38.8,18.5 38.8,15.5 38.5,15.2 v37.8,15.2
  Bottom 0.2: v55.4,27.2 54,25.9 53.1,25.9 52.4,25.3 v52.4,24.4
N$57  (via drill 0.2)
  Top 0.182: U1.J01 53.1,27.6 52.5,27 52.5,25.8 51.1,24.4 v50.3,24.4
  Top 0.254: R27.2 v36.7,15.2
  GND,Signal 0.182: v50.3,24.4 50.3,19.7 50.1,19.5 36,19.5 35.7,19.2 35.7,15.5 36,15.2 v36.7,15.2
N$58
  Supply 0.1: 3,6 3,0
N$59
  Supply 0.1: 0,3 6,3
N$60  (via drill 0.2)
  Top 0.2: F1.P$2 65,39.7 64.6,40 63.5,40 63.2,39.7 U3.P5 | U1.E11 v62.9,31.4
  Top 0.254: v65.8,34 65.8,34.7 66.3,35.1 67,35.1 67.4,35.5 C39.1 67.8,36
  Top 0.406: F1.P$2 66.65,39.4 66.9,39.4 67.1,39.2 67.1,38.6 67.4,38.3 C39.1 67.8,36.6 67.8,36.8 68.4,37.4 69.45,37.4 U6.1 69.2,37.45 69.2,37.8 69.8,38.4 71.2,38.4 72.5,39.7 72.5,40.5 72.9,40.9 77.7,40.9 78.5,40.1 C37.+ 78.6,38.2 80.2,38.2 80.6,37.8 80.6,33.8 80,33.2 78.7,33.2 78,32.5 78,28.52 U5.1 | 67.8,36 67.8,35.9 68.2,35.5 69.25,35.5 U6.3
  Bottom 0.2: v62.9,31.4 62.9,31.9 64.1,33.1 64.7,33.1 C27.2 65.6,33.25 65.8,33.4 v65.8,34
N$61
  Top 0.406: L2.1 65.69,41.41 64.6,42.5 JP1.VBUS
N$62
  Top 0.406: 84.65,46 86.5,46 87,45.5 C43.1 L8.1
  Top 0.61: U8.2 84.65,46
N$63
  Top 0.406: U10.2 36.55,45.95 37,45.5 C60.1 38.9,44.45
  Top 0.61: 38.9,44.45 L9.1
N$64
  Top 0.406: U11.2 26.55,45.95 27,45.5 C63.1 28.9,44.45
  Top 0.61: 28.9,44.45 L10.1
N$65
  Top 0.2: JP2.1 42.9,35.48 42.9,35.4 45.3,33 48.9,33 52.4,29.6 56.2,29.6 U1.G04
  Top 0.4: 42.9,35.48 43.41,35.96 JP2.1 42.39,35.96 42.9,35.48
N$66
  Bottom 0.1: 3,6 3,0
N$67
  Bottom 0.1: 0,3 6,3
N$68
  Bottom 0.1: 3,66 3,60
N$69
  Bottom 0.1: 0,63 6,63
N$70
  Bottom 0.1: 123,66 123,60
N$71
  Bottom 0.1: 120,63 126,63
N$72
  GND,Signal 0.1: 3,66 3,60
N$73
  GND,Signal 0.1: 0,63 6,63
N$74
  GND,Signal 0.1: 3,6 3,0
N$75
  GND,Signal 0.1: 0,3 6,3
N$76
  GND,Signal 0.1: 123,66 123,60
N$77
  GND,Signal 0.1: 120,63 126,63
N$78
  Supply 0.1: 3,66 3,60
N$79
  Supply 0.1: 0,63 6,63
N$80
  Supply 0.1: 123,66 123,60
N$81
  Supply 0.1: 120,63 126,63
N$84
  Top 0.1: 30.07,33.75 30.07,32.75 OV5653_RIGHT.B04
  Top 0.2: 30.07,33.75 30.07,36.7 30.9,37.5 32.5,37.5 33.7,36.3 R33.1
N$85
  Top 0.1: 29.18,28.1 29.18,27.1
N$86
  Top 0.1: OV5653_LEFT.A05 90.38,33.7
  Top 0.15: 90.38,33.7 90.38,37.33 90.2,37.5 R34.1
N$87  (via drill 0.2)
  Top 0.182: v60.2,28 58.6,28 U1.J06
  Bottom 0.182: v60.2,28 60.4,27.8 61.4,27.8 62.6,26.6 63.3,26.6 64.6,25.3 65.8,25.3 69,22.1 70.4,22.1 70.8,22.5 81.4,22.5 82.3,21.6 82.3,20.2 82.9,19.6 90.4,19.6 92.1,21.3 R3.2
N$88  (via drill 0.2)
  Top 0.182: v61,27.2 U1.J10
  Bottom 0.182: v61,27.2 60.7,26.9 60.7,25.3 59.6,24.2 59.6,22.1 58.3,20.8 52.3,20.8 50.3,18.8 29.2,18.8 27.3,20.7 R11.2
N$89  (via drill 0.2)
  Top 0.182: v60.2,27.2 U1.J09
  Bottom 0.182: v60.2,27.2 60,27 60,25.2 59.2,24.4 59.2,22.3 58.2,21.3 51.9,21.3 49.8,19.2 29.5,19.2 28.3,20.4 R10.2
N$90  (via drill 0.2)
  Top 0.182: U1.K11 61.8,26.4 61.8,23.5 58.6,20.3 49.7,20.3 v49.4,20.2
  Bottom 0.182: v49.4,20.2 49.4,19.8 49.2,19.6 29.8,19.6 29.3,20.1 R9.2
N$91  (via drill 0.2)
  Top 0.182: U1.L10 61.4,23.7 58.5,20.8 48.9,20.8 v48.3,20.2
  Bottom 0.182: R8.2 30.3,20.4 30.7,20 48.1,20 v48.3,20.2
  Bottom 0.2: 48.2,20.1 v48.3,20.2
N$92  (via drill 0.2)
  Top 0.182: U1.K10 61,26.4 61,23.9 58.4,21.3 v48.3,21.3
  Bottom 0.182: v48.3,21.3 47.4,20.4 31.5,20.4 31.3,20.6 R7.2
N$93  (via drill 0.2)
  Top 0.182: U1.K09 60.2,26.4 60.2,24.9 59.8,24.5 59.8,23.3 58.3,21.8 49.7,21.8 v49.4,22
  Bottom 0.182: v49.4,22 46.1,22 45.2,21.1 40.7,21.1 38.9,22.9 38.2,22.9 36.1,20.8 32.5,20.8 32.3,21 R6.2
N$94  (via drill 0.2)
  Top 0.182: v59.4,27.2 U1.J08
  Bottom 0.182: v59.4,27.2 59.4,25.2 58.8,24.6 58.8,22.5 58.1,21.8 50.5,21.8 49,23.3 45.9,23.3 44.1,21.5 41.1,21.5 39.1,23.5 38,23.5 35.7,21.2 33.6,21.2 33.3,21.5 R5.2
N$95  (via drill 0.2)
  Top 0.182: v59.4,28.8 U1.G08
  Bottom 0.182: v59.4,28.8 59.4,28 58.7,27.3 58.7,25.2 58.4,24.9 58.4,22.7 58,22.3 50.9,22.3 49.4,23.8 45.7,23.8 43.8,21.9 41.5,21.9 39.3,24.1 37.8,24.1 35.6,21.9 34.5,21.9
  Bottom 0.2: 34.5,21.9 R4.2
N$96  (via drill 0.2)
  Top 0.182: U1.J05 v57,28
  Bottom 0.182: v57,28 56.4,28.6 54.9,28.6 54.7,28.4 54.7,27.2 54.4,26.9 51.1,26.9 50.8,27.2 50.11,27.2 arc-90 49.83,27.48 arc90 49.56,27.76 49.36,27.76 arc90 49.08,27.48 49.08,26.92 arc-90 48.81,26.65 48.61,26.65 arc-90 48.33,26.92 48.33,27.48 arc90 48.05,27.76 47.86,27.76 arc90 47.58,27.48 47.58,26.92 arc-90 47.3,26.65 47.11,26.65 arc-90 46.83,26.92 46.83,27.48 arc90 46.55,27.76 46.36,27.76 arc90 46.08,27.48 46.08,26.92 arc-90 45.8,26.65 45.6,26.65 arc-90 45.33,26.92 45.33,27.48 arc90 45.05,27.76 44.86,27.76 arc90 44.58,27.48 arc-90 44.3,27.2 44,27.2 43.3,26.5 R21.2
N$97  (via drill 0.2)
  Top 0.182: U1.H05 57,28.8 50.7,28.8 50.4,29.1 49.3,29.1 49,28.8 48.8,28.8 48.52,29.08 arc90 48.24,29.36 48.18,29.36 arc90 47.91,29.08 47.91,28.52 arc-90 47.63,28.24 47.57,28.24 arc-90 47.29,28.52 47.29,29.08 arc90 47.01,29.36 46.95,29.36 arc90 46.67,29.08 46.67,28.52 arc-90 46.4,28.24 46.33,28.24 arc-90 46.05,28.52 46.05,29.08 arc90 45.78,29.36 45.72,29.36 arc90 45.44,29.08 45.44,28.52 arc-90 45.16,28.24 45.1,28.24 arc-90 44.82,28.52 44.82,29.08 arc90 44.54,29.36 44.48,29.36 arc90 44.2,29.08 44.2,28.52 arc-90 43.93,28.24 43.86,28.24 arc-90 43.59,28.52 43.59,29.08 arc90 43.31,29.36 43.25,29.36 arc90 42.97,29.08 arc-90 42.69,28.8 42.5,28.8 41.5,27.8 v40.6,27.8
  Bottom 0.182: R20.2 v40.6,27.8
N$98
  Top 0.1: 90.08,33.7 90.08,32.74 OV5653_LEFT.B04
  Top 0.15: R35.1 89.9,35.9 90.08,35.7 90.08,33.7
N$99  (via drill 0.2)
  Top 0.2: U1.H06 v57.8,28
  GND,Signal 0.2: v57.8,28 58.4,28 58.6,27.8 58.6,27 60.2,25.4 64.7,25.4 65.7,26.4 v69.1,26.4
  Bottom 0.182: v69.1,26.4 71.3,26.4 71.8,25.9 79.1,25.9 80.2,27 R24.2
N$100  (via drill 0.2)
  Top 0.2: U1.K05 v57.8,27.2
  GND,Signal 0.2: v57.8,27.2 60,25 65,25 65.6,25.6 72.8,25.6 v73.8,26.6
  Bottom 0.182: v73.8,26.6 79.1,26.6 80.2,27.7 81.1,27.7 81.4,28 R23.2
N$101  (via drill 0.2)
  Top 0.182: v60.2,30.4 U1.F08
  Bottom 0.182: v60.2,30.4 60.8,29.8 62.1,29.8 63.7,28.2 64.4,28.2 65.6,27 67.1,27 68.9,25.2 71.8,25.2 72,25 79.1,25 79.6,25.5 81.4,25.5 81.9,25 82.5,25 83.2,25.7 84.2,25.7 84.9,25 84.9,22.3 85.3,21.9 86.9,21.9
  Bottom 0.2: 86.9,21.9 R14.2
N$102  (via drill 0.2)
  Top 0.182: v70.2,21.2 70.2,22.3 70.4,22.5 70.4,23 70,23.4 69.1,23.4 66.5,26 66.5,27.9 66,28.4 63.2,28.4 62.8,28.8 61.8,28.8 U1.H10
  Bottom 0.182: v70.2,21.2 70.6,20.8 80.1,20.8 82.2,18.7 91.5,18.7 94.1,21.3 R13.2
N$103  (via drill 0.2)
  Top 0.182: U1.H09 61,28 62.4,28 63.4,27 64.9,27 68.8,23.1 68.8,22.3 69.5,21.6 v69.5,20.7
  Bottom 0.182: v69.5,20.7 69.8,20.4 79.8,20.4 81.9,18.3 92.3,18.3 95.1,21.1 R12.2
N$105
  Top 0.15: 29.18,27.1 29.18,26.9
N$106  (via drill 0.2)
  Top 0.182: v59.4,29.6 U1.F07
  Bottom 0.182: v59.4,29.6 60.8,28.2 61.9,28.2 63.1,27 63.8,27 65,25.8 66.5,25.8 68.7,23.6 69.9,23.6 70.3,23.2 71.9,23.2 72.1,23.4 79.9,23.4 80.3,23.8 80.7,23.8 81.1,23.4 81.7,23.4 83,22.1 83,20.5 83.4,20.1 90.1,20.1 91.1,21.1 R17.2
N$107  (via drill 0.2)
  Top 0.182: v61,28.8 61,29.6 U1.F09
  Bottom 0.182: v61,28.8 61.9,28.8 63.3,27.4 64,27.4 65.2,26.2 66.7,26.2 68.6,24.3 70,24.3 70.7,23.6 71.5,23.6 71.7,23.8 79.7,23.8 80.2,24.3 80.8,24.3 81.3,23.8 82.7,23.8 83.6,22.9 83.6,21 84.1,20.5 89.4,20.5 90.1,21.2 R18.2
N$108  (via drill 0.2)
  Top 0.182: v71.1,24.2 69.5,24.2 67.3,26.4 67.3,28.3 66.1,29.5 64.9,29.5 63.6,30.8 63,30.8 62.6,30.4 61.8,30.4 U1.F10
  Bottom 0.182: R19.2 89.1,21.3 88.7,20.9 84.7,20.9 84.1,21.5 84.1,24.5 83.9,24.7 83.5,24.7 83,24.2 81.5,24.2 81,24.7 80,24.7 79.5,24.2 v71.1,24.2
OV_RESET1  (via drill 0.2)
  Top 0.1: OV5653_LEFT.A04 89.78,33.72
  Top 0.15: v89.5,35.5 89.78,35.22 89.78,33.72
  Bottom 0.2: R40.2 89.53,35.58 v89.5,35.5 R99.2
OV_RESET2  (via drill 0.2)
  Top 0.1: OV5653_RIGHT.A04 29.78,34.83 29.5,35.1
  Top 0.2: 29.5,35.1 v29.5,35.6 29.5,37.4 30,37.9 32.8,37.9 33.4,37.3 R98.2
  Bottom 0.2: R22.2 v29.5,35.6
PCLK  (via drill 0.2)
  Top 0.1: OV5653_LEFT.J03 89.17,27.1
  Top 0.15: 89.17,27.1 89.17,25.27 v88.3,24.4
  Bottom 0.182: R3.1 92.1,24.1 91.4,24.8 88.7,24.8 v88.3,24.4
RESET_IN  (via drill 0.2)
  Top 0.2: U1.C05 v57,32.8 | v51.8,35 50.75,35 C41.1 R36.2
  Top 0.254: R36.2 50.67,36.5 49.6,36.5 48.1,35 47.05,35 S1.2
  Bottom 0.2: v57,32.8 56.4,33.4 54.5,33.4 53.7,34.1 53.7,34.5 53.4,34.8 52,34.8 v51.8,35
SS_RX_M
  Top 0.15: U1.A04 arc-17 56.3,34.5 arc-23 56,36 56,39.8 56.1,39.9 U2.P7 U2.P4 56.1,41.6 56,41.7 56,42.6 55.95,42.65 JP1.USB3_RXDM
SS_RX_P
  Top 0.15: U1.A03 arc51 55.9,34.7 arc-17 55.7,36 55.7,39.8 55.6,39.9 U2.P6 U2.P5 55.6,41.6 55.7,41.7 55.7,42.45 55.3,42.85 JP1.USB3_RXDP
SS_TX_M
  Top 0.15: C28.1 57.6,38.2 57.6,38.4 57.5,38.5 57.5,39.8 57.6,39.9 U2.P10 U2.P1 57.6,41.6 57.5,41.7 57.5,42.5 57.9,42.9 JP1.USB3_TXDM
  Top 0.2: 57.7,38.05 C28.1
SS_TX_P
  Top 0.15: C29.1 56.9,38.25 57.2,38.5 57.2,39.8 57.1,39.9 U2.P9 U2.P2 57.1,41.6 57.2,41.7 57.2,42.65 57.25,42.7 JP1.USB3_TXDP
STROBE  (via drill 0.2)
  Top 0.15: R34.2 v87.4,37.5
  Top 0.2: U1.D04 56.2,32 v56.2,32.8
  GND,Signal 0.2: v87.4,37.5 86.9,37.8 83.2,37.8 74.8,29.3 70,29.3 69.2,30.1 68.2,30.1 67.4,29.3 65.6,29.3 65.3,29.6 62.6,29.6 62.2,30 62.2,32.5 61.7,33 58.1,33 57.3,32.2 56.7,32.2 v56.2,32.8
VCC  (via drill 0.2)
  Top 0.15: 87.96,28.1 OV5653_LEFT.J01 87.17,27.32 v87.17,27.1 | OV5653_LEFT.F01 87.18,30.29 v86.9,30 | OV5653_LEFT.J07 91.58,27.2 v91.38,27
  Top 0.406: L8.2 89,41 88.4,40.4 86.5,40.4 83,36.9 83,30.6 84.8,28.8 84.8,25.7 85.4,25.1 87.1,25.1 87.47,25.48 C49.1 87.47,26.8 v87.17,27.1
  Bottom 0.15: v86.9,30 86.9,28.9 | 86.9,28.9 86.9,27.48 v87.17,27.1 | 86.9,28.9 90.9,28.9 91.38,28.43 v91.38,27
VCC2  (via drill 0.2)
  Top 0.15: v31.27,26.95 31.57,27.36 OV5653_RIGHT.J07 | OV5653_RIGHT.J01 27.27,27.5 v27.27,27.16
  Top 0.2: v27.48,29.86 27.55,29.86 OV5653_RIGHT.F01
  Top 0.406: v27.27,27.16 27.48,26.76 C56.1 27.48,25.55 27.1,25.2 25.3,25.2 24.3,26.2 24.3,36.1 29,40.7 L10.2
  Bottom 0.15: 27.27,28.55 30.48,28.55 31.27,27.76 v31.27,26.95 | v27.27,27.16 27.27,28.55 | 27.27,28.55 27.27,29.55 v27.48,29.86
VCCIO  (via drill 0.2, 0.2 pad 0.3, 0.2 pad 0.5, 0.4)
  Top 0.1: OV5653_RIGHT.H09 32.17,29.75 | 92.72,29.2 92.2,29.8 | v88.88,33.65 88.88,32.74 OV5653_LEFT.B02 | v28.88,33.75 28.88,32.74 OV5653_RIGHT.B02
  Top 0.15: OV5653_RIGHT.H09 OV5653_RIGHT.H10 34.15,29.2 34.6,29.6 34.6,32.4 | OV5653_RIGHT.B07 OV5653_RIGHT.A07 v31.58,33.66 | OV5653_RIGHT.I02 OV5653_RIGHT.I01 26.24,28.66 C57.1 | OV5653_RIGHT.I06 30.98,29.46 31.27,29.75 32.17,29.75 | 92.2,29.8 91.4,29.8 90.97,29.35 OV5653_LEFT.I06 | v91.58,33.65 OV5653_LEFT.A07 OV5653_LEFT.B07 | OV5653_LEFT.A08 92.17,33.88 92.4,34.1 92.4,34.62 C48.1 | 92.72,29.2 OV5653_LEFT.H09 OV5653_LEFT.H10 94.22,29.2 94.58,29.55 94.58,32.44 | 86.33,29.2 C50.1 86.85,29.25 87.44,28.66 OV5653_LEFT.I01 OV5653_LEFT.I02 | OV5653_LEFT.B09 OV5653_LEFT.B10 94.58,32.44 | C66.1 89.2,34.6 | 89.2,34.75 C66.1 | OV5653_LEFT.A03 89.17,33.03 89.4,33.25 89.4,34.05 C66.1 | v87.6,29.7 87.6,29.6 87.68,29.5 OV5653_LEFT.H01 | OV5653_RIGHT.A03 29.18,33.23 29.4,33.45 29.4,34.5 29.2,34.7 28.7,34.7 C65.1 | OV5653_RIGHT.H01 27.09,29.2 26.9,29.4 26.9,30.3 26.7,30.5 26.7,32.7 v27.1,33.1 | 94.58,32.44 94.58,33.35 v94.47,33.45 | OV5653_RIGHT.B09 OV5653_RIGHT.B10 34.54,32.45 34.6,32.4 | v34.45,33.5 34.6,33.3 34.6,32.4 | OV5653_RIGHT.A08 32.17,33.92 32.1,34 32.1,34.73 C55.1
  Top 0.182: v60.4,24.2 60.6,24.4 U1.L09
  Top 0.2: C55.1 32.1,34.9 v32.1,36.8 | C36.1 49.6,24.4 48.6,23.4 R37.2 47.2,23.38 47.2,22.6 46.9,22.3 43.9,22.3 43.6,22.6 43.6,22.9 R38.2 | 39,41.3 R26.1 | OV5653_LEFT.A07 | U1.E03 v55.4,31.2 | v65.7,27.8 63.2,27.8 62.6,28.4 U1.H11 | U1.C11 63.5,32.4 v64,32.1 | U1.F01 v54.6,30.4 | C36.1 49.15,25.65 49.3,25.5 | v61.8,22 64,22 64.6,21.4 C64.1 64.6,19.25 U9.4 | 49.45,25.6 C36.1 | 89.2,34.75 89.2,34.9 88.9,35.2 87.1,35.2 86.7,35.6 86.7,37.4 85.8,38.3 | 47.9,25.5 47.8,25.2 U4.8 48.1,25.7 49.45,25.7 C36.1 | C65.1 28.75,35 28.75,37.95 28.5,38.2
  Top 0.406: L9.2 39,41.3 37,39.3 29.6,39.3 28.5,38.2 27.9,37.6 v27.9,36.8 v26.9,36.8 | C57.1 v26.2,30 | L7.2 99,40.9 97.2,39.1 92.38,39.1 | 92.38,36.25 C48.1 92.47,34.55 | v94.38,36.35 92.47,36.35 92.38,36.25 | 92.38,36.25 92.38,39.1 | 92.38,39.1 86.6,39.1 85.8,38.3 84.17,36.65 v84.17,31.05 84.17,30.95 85.88,29.25 C50.1 | v50.7,26.3 50.1,25.7 49.65,25.7 C36.1
  Supply 0.2: 47.3,29.6 47.3,29.7
  Supply 0.406: v56.6,23.2 62.6,23.2 | 62.6,23.2 67.1,23.2 70.1,26.2 70.1,28 v68.7,29.4 | 59.3,16.5 v59.3,17.1 v59.3,17.9 | v51,29.6 47.3,29.6 | v61.8,22 62.3,22 62.6,22.3 62.6,23.2 | v50.7,26.3 48.5,26.3 47.3,27.5 47.3,29.7 42.3,34.7 v41.5,34.7
  Supply 0.61: 54.02,16.5 59.3,16.5 60.4,15.4 80.3,15.4 82.5,17.5 82.5,27 84.17,29.15 v84.17,31.05 v84.17,32.15 | 54.02,16.5 JP3.1 | JP3.1 53,17.52 | 53,17.52 53,17.7 51.9,18.8 24.9,18.8 v23.7,20 v23.7,21.2 | 54.02,16.5 53.21,16.91 JP3.1 | 54.02,16.5 53.21,16.09 JP3.1 | 53,17.52 52.59,16.71 JP3.1 | 53,17.52 53.41,16.71 JP3.1
  Bottom 0.15: C58.1 v34.45,33.5 34.28,33.66 v31.58,33.66 | v88.88,33.65 90.9,33.65 | 90.9,33.65 v91.58,33.65 | v87.6,29.7 88.8,29.7 89.2,29.3 90.4,29.3 90.9,29.8 90.9,33.65 | v27.1,33.1 27.7,33.65 27.83,33.75 v28.88,33.75
  Bottom 0.2: v28.88,33.75 30.18,33.75 31.4,32.6 C58.1 | 51.5,30.6 51.3,30.6 C18.1 51,30.4 v51,29.6 52.1,29.6 C16.1 | C51.1 v94.47,33.45 94.28,33.65 v91.58,33.65 | v56.6,23.2 56.2,23.2 55.8,22.8 55,22.8 54.6,23.2 54.17,23.2 R25.1 | v60.4,24.2 60.6,24.4 C14.1 C15.1 61.4,22.7 61.8,22.3 v61.8,22 | v64,32.1 C22.1 C23.1 67.9,32.1 68.7,31.3 v68.7,29.4 68,29.4 67.5,28.9 67.5,28.2 67.15,27.85 C24.1 66.35,27.8 v65.7,27.8 | v54.6,30.4 53.9,29.7 C17.1 | v55.4,31.2 54.5,31.2 C19.1 53.8,30.6 51.5,30.6 | 51.5,30.6 51.2,30.3 | R22.1 32.67,36.73 32.6,36.8 | R40.1 94.03,36.7 v94.38,36.35
  Bottom 0.254: C16.1 C17.1
  Bottom 0.406: 23.7,30.1 23.7,35.3 25.2,36.8 v27.9,36.8 v32.1,36.8 32.6,36.8 34.4,36.8 | v94.38,36.35 95.9,34.75 95.9,32.73 C52.1 94.62,32.7 | v61.8,22 61,22 59.3,20.3 v59.3,17.1 | 23.7,30.1 v23.7,20 | 35.98,32.68 C59.1 | 35.89,32.6 C59.1 | C59.1 35.9,35.1 34.4,36.8 | v41.5,34.7 38.1,34.7 37.6,35.2 36.1,36.8 34.4,36.8 | 23.7,30.1 26.13,30.1 v26.2,30 | C59.1 35.85,32.6 C58.1
  Bottom 0.61: 94.62,32.7 C51.1
VH  (via drill 0.2)
  Top 0.1: OV5653_RIGHT.B08 v31.57,31.86
  Bottom 0.15: v31.57,31.86 31.57,31.25 C53.1
VN
  Top 0.15: C54.1 33.27,34.75 33.08,34.55 33.08,33.45 OV5653_RIGHT.A09
VSYNC  (via drill 0.2)
  Top 0.1: OV5653_LEFT.B03 89.67,31.95
  Top 0.15: OV5653_LEFT.B03 | 89.67,31.95 arc-37 89.8,31.7 arc55 v90.38,31.1
  Bottom 0.15: 84.38,29.35 85.95,30.9 88.5,30.9 88.8,30.6 89.97,30.6 v90.38,31.1
  Bottom 0.182: R23.1 84.1,28
  Bottom 0.2: 84.38,29.35 84.38,28.27 84.1,28
VSYNC2  (via drill 0.2)
  Top 0.1: OV5653_RIGHT.B03 29.68,31.95
  Top 0.15: OV5653_RIGHT.B03 | 29.68,31.95 29.68,31.45 v29.88,31.25
  Bottom 0.15: v29.88,31.25 30.27,31.25 33.38,28.16 35.98,28.16 36.4,27.75 36.95,27.75 R20.1
(copper drawn outside any net)
  shapes: Bottom circle x9, GND,Signal circle x9, Supply circle x9, Top circle x9

## Text on the board
Top: A
GND,Signal: B
Supply: C
Bottom: D
tPlace: PWR | PMODE | RESET | OVPRO v1.1 | GPIO
Document: Long hole (X0.7Y1.3) | 35 mm | 60 mm | 95 mm | Copyright(C)2015 Wizapply.